# Altium project 2024_WSB.PrjPcb (part 1 of 3)
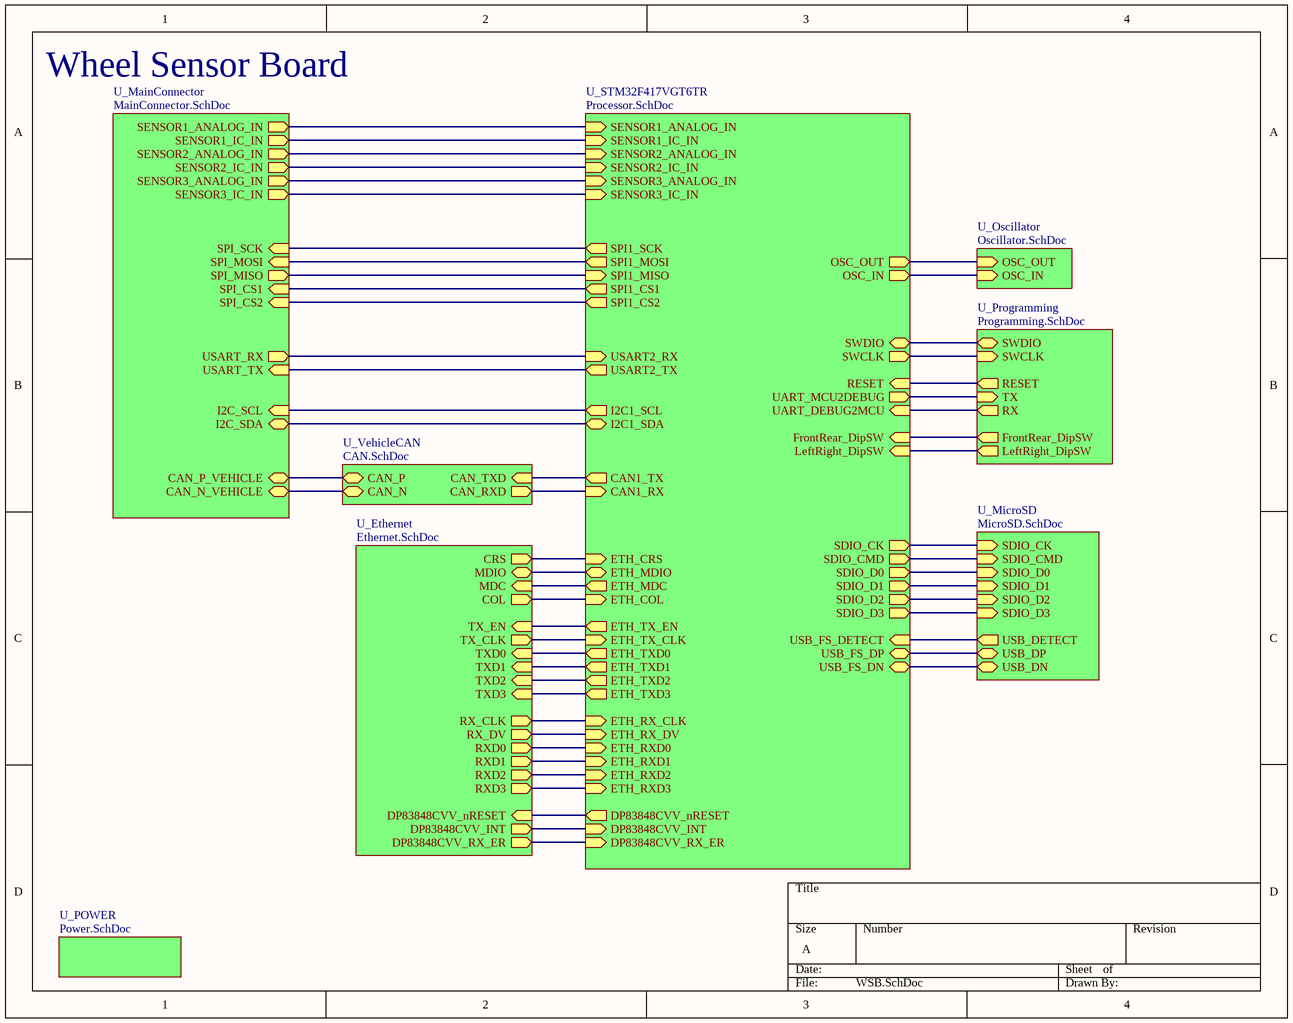
[diagram p0: WSB.SchDoc]
11 sheets, 201 parts. Net scope: hierarchical (ports join the sheet entries above them; power ports are global).
Board file: 2024_WSB.PcbDoc
Sheets:
  WSB.SchDoc
    U_MicroSD = MicroSD.SchDoc
    U_Programming = Programming.SchDoc
    U_VehicleCAN = CAN.SchDoc
    U_Oscillator = Oscillator.SchDoc
    U_STM32F417VGT6TR = Processor.SchDoc
    U_MainConnector = MainConnector.SchDoc
      U_SensorInput1 = SensorInput.SchDoc
      U_SensorInput2 = SensorInput.SchDoc
      U_SensorInput3 = SensorInput.SchDoc
      U_SensorPower2 = SensorPower.SchDoc
      U_SensorPower1 = SensorPower.SchDoc
      U_SensorPower3 = SensorPower.SchDoc
      U_I2CSensorPower1 = SensorPower.SchDoc
      U_I2CSensorPower2 = SensorPower.SchDoc
      U_SPISensorPower1 = SensorPower.SchDoc
      U_SPISensorPower2 = SensorPower.SchDoc
    U_Ethernet = Ethernet.SchDoc
    U_POWER = Power.SchDoc

## Sheet WSB.SchDoc
size A; SheetNumber: 1; SheetTotal: 11

### Sub-sheets
U_Ethernet = Ethernet.SchDoc: DP83848CVV_INT (out), DP83848CVV_nRESET (in), CRS (out), RX_CLK (out), MDIO (bidir), COL (out), RX_DV (out), RXD2 (out), RXD3 (out), TX_EN (in), TXD0 (in), TXD1 (in), MDC (in), TXD2 (in), TX_CLK (out), RXD0 (out), RXD1 (out), TXD3 (in), DP83848CVV_RX_ER (out)
U_MainConnector = MainConnector.SchDoc: CAN_N_VEHICLE (bidir), CAN_P_VEHICLE (bidir), I2C_SDA (bidir), I2C_SCL (in), USART_TX (in), USART_RX (out), SPI_SCK (in), SPI_MOSI (in), SPI_MISO (out), SPI_CS1 (in), SPI_CS2 (in), SENSOR1_ANALOG_IN (out), SENSOR1_IC_IN (out), SENSOR2_ANALOG_IN (out), SENSOR2_IC_IN (out), SENSOR3_ANALOG_IN (out), SENSOR3_IC_IN (out)
U_MicroSD = MicroSD.SchDoc: SDIO_CK (in), SDIO_CMD (in), SDIO_D0 (in), SDIO_D1 (in), SDIO_D2 (in), SDIO_D3 (in), USB_DETECT (out), USB_DN (bidir), USB_DP (bidir)
U_Oscillator = Oscillator.SchDoc: OSC_IN (in), OSC_OUT (in)
U_POWER = Power.SchDoc: no entries
U_Programming = Programming.SchDoc: SWDIO (bidir), SWCLK (in), RESET (out), TX (in), RX (out), FrontRear_DipSW (out), LeftRight_DipSW (out)
U_STM32F417VGT6TR = Processor.SchDoc: SDIO_D0 (out), SDIO_D1 (out), SDIO_D2 (out), SDIO_D3 (out), SDIO_CK (out), SDIO_CMD (out), ETH_MDC (out), ETH_MDIO (bidir), I2C1_SCL (out), I2C1_SDA (bidir), SWDIO (bidir), SWCLK (out), UART_DEBUG2MCU (in), UART_MCU2DEBUG (out), CAN1_TX (out), RESET (in), ETH_COL (in), ETH_CRS (in), ETH_RXD0 (in), ETH_RXD1 (in), ETH_RXD2 (in), ETH_RXD3 (in), ETH_RX_CLK (in), ETH_RX_DV (in), ETH_TXD0 (out), ETH_TXD1 (out), ETH_TXD2 (out), ETH_TXD3 (out), ETH_TX_CLK (in), ETH_TX_EN (out), USB_FS_DN (bidir), USB_FS_DP (bidir), OSC_OUT (out), OSC_IN (out), USB_FS_DETECT (in), DP83848CVV_INT (in), DP83848CVV_nRESET (out), DP83848CVV_RX_ER (in), SPI1_SCK (out), SPI1_MOSI (out), USART2_TX (out), USART2_RX (in), SENSOR1_ANALOG_IN (in), SENSOR1_IC_IN (in), SPI1_MISO (in), SENSOR2_ANALOG_IN (in), SENSOR3_ANALOG_IN (in), SENSOR2_IC_IN (in), SENSOR3_IC_IN (in), FrontRear_DipSW (in), LeftRight_DipSW (in), CAN1_RX (in), SPI1_CS1 (out), SPI1_CS2 (out)
U_VehicleCAN = CAN.SchDoc: CAN_P (bidir), CAN_N (bidir), CAN_TXD (in), CAN_RXD (out)

### Nets
CAN_CONN_H: sheet U_VehicleCAN/CAN_P, sheet U_MainConnector/CAN_P_VEHICLE
CAN_CONN_L: sheet U_VehicleCAN/CAN_N, sheet U_MainConnector/CAN_N_VEHICLE
I2C_SCL: sheet U_STM32F417VGT6TR/I2C1_SCL, sheet U_MainConnector/I2C_SCL
I2C_SDA: sheet U_STM32F417VGT6TR/I2C1_SDA, sheet U_MainConnector/I2C_SDA
MII_MDC: sheet U_STM32F417VGT6TR/ETH_MDC, sheet U_Ethernet/MDC
MII_MDIO: sheet U_STM32F417VGT6TR/ETH_MDIO, sheet U_Ethernet/MDIO
RESET: sheet U_Programming/RESET, sheet U_STM32F417VGT6TR/RESET
SD_CK: sheet U_MicroSD/SDIO_CK, sheet U_STM32F417VGT6TR/SDIO_CK
SD_CMD: sheet U_MicroSD/SDIO_CMD, sheet U_STM32F417VGT6TR/SDIO_CMD
SD_D0: sheet U_MicroSD/SDIO_D0, sheet U_STM32F417VGT6TR/SDIO_D0
SD_D1: sheet U_MicroSD/SDIO_D1, sheet U_STM32F417VGT6TR/SDIO_D1
SD_D2: sheet U_MicroSD/SDIO_D2, sheet U_STM32F417VGT6TR/SDIO_D2
SD_D3: sheet U_MicroSD/SDIO_D3, sheet U_STM32F417VGT6TR/SDIO_D3
SPI_MISO: sheet U_STM32F417VGT6TR/SPI1_MISO, sheet U_MainConnector/SPI_MISO
SPI_MOSI: sheet U_STM32F417VGT6TR/SPI1_MOSI, sheet U_MainConnector/SPI_MOSI
SPI_SCK: sheet U_STM32F417VGT6TR/SPI1_SCK, sheet U_MainConnector/SPI_SCK
SWCLK: sheet U_Programming/SWCLK, sheet U_STM32F417VGT6TR/SWCLK
SWDIO: sheet U_Programming/SWDIO, sheet U_STM32F417VGT6TR/SWDIO
UART_DGB2MCU: sheet U_Programming/RX, sheet U_STM32F417VGT6TR/UART_DEBUG2MCU
UART_MCU2DGB: sheet U_Programming/TX, sheet U_STM32F417VGT6TR/UART_MCU2DEBUG
USART_RX: sheet U_STM32F417VGT6TR/USART2_RX, sheet U_MainConnector/USART_RX
USART_TX: sheet U_STM32F417VGT6TR/USART2_TX, sheet U_MainConnector/USART_TX
USB_BOARD_N: sheet U_MicroSD/USB_DN, sheet U_STM32F417VGT6TR/USB_FS_DN
USB_BOARD_P: sheet U_MicroSD/USB_DP, sheet U_STM32F417VGT6TR/USB_FS_DP
NetC22_2: sheet U_Oscillator/OSC_IN, sheet U_STM32F417VGT6TR/OSC_IN
NetIC1_7: sheet U_STM32F417VGT6TR/DP83848CVV_INT, sheet U_Ethernet/DP83848CVV_INT
NetIC1_29: sheet U_STM32F417VGT6TR/DP83848CVV_nRESET, sheet U_Ethernet/DP83848CVV_nRESET
NetIC1_41: sheet U_STM32F417VGT6TR/DP83848CVV_RX_ER, sheet U_Ethernet/DP83848CVV_RX_ER
NetR6_1: sheet U_Programming/LeftRight_DipSW, sheet U_STM32F417VGT6TR/LeftRight_DipSW
NetR7_1: sheet U_Programming/FrontRear_DipSW, sheet U_STM32F417VGT6TR/FrontRear_DipSW
NetR10_1: sheet U_Oscillator/OSC_OUT, sheet U_STM32F417VGT6TR/OSC_OUT
NetR11_1: sheet U_STM32F417VGT6TR/ETH_RXD0, sheet U_Ethernet/RXD0
NetR12_1: sheet U_STM32F417VGT6TR/ETH_TXD0, sheet U_Ethernet/TXD0
NetR13_1: sheet U_STM32F417VGT6TR/ETH_RXD1, sheet U_Ethernet/RXD1
NetR14_1: sheet U_STM32F417VGT6TR/ETH_TXD1, sheet U_Ethernet/TXD1
NetR15_1: sheet U_STM32F417VGT6TR/ETH_RXD2, sheet U_Ethernet/RXD2
NetR16_1: sheet U_STM32F417VGT6TR/ETH_TXD2, sheet U_Ethernet/TXD2
NetR17_1: sheet U_STM32F417VGT6TR/ETH_RXD3, sheet U_Ethernet/RXD3
NetR18_1: sheet U_STM32F417VGT6TR/ETH_TXD3, sheet U_Ethernet/TXD3
NetR19_1: sheet U_STM32F417VGT6TR/ETH_TX_CLK, sheet U_Ethernet/TX_CLK
NetR20_1: sheet U_STM32F417VGT6TR/ETH_TX_EN, sheet U_Ethernet/TX_EN
NetR23_1: sheet U_STM32F417VGT6TR/ETH_CRS, sheet U_Ethernet/CRS
NetR24_1: sheet U_STM32F417VGT6TR/ETH_RX_DV, sheet U_Ethernet/RX_DV
NetR25_1: sheet U_STM32F417VGT6TR/ETH_RX_CLK, sheet U_Ethernet/RX_CLK
NetR26_1: sheet U_STM32F417VGT6TR/ETH_COL, sheet U_Ethernet/COL
NetR45_1: sheet U_STM32F417VGT6TR/SPI1_CS2, sheet U_MainConnector/SPI_CS2
NetR46_2: sheet U_STM32F417VGT6TR/SPI1_CS1, sheet U_MainConnector/SPI_CS1
NetR47_1: sheet U_STM32F417VGT6TR/SENSOR1_ANALOG_IN, sheet U_MainConnector/SENSOR1_ANALOG_IN
NetR48_1: sheet U_STM32F417VGT6TR/SENSOR1_IC_IN, sheet U_MainConnector/SENSOR1_IC_IN
NetR49_1: sheet U_STM32F417VGT6TR/SENSOR2_ANALOG_IN, sheet U_MainConnector/SENSOR2_ANALOG_IN
NetR50_1: sheet U_STM32F417VGT6TR/SENSOR2_IC_IN, sheet U_MainConnector/SENSOR2_IC_IN
NetR51_1: sheet U_STM32F417VGT6TR/SENSOR3_ANALOG_IN, sheet U_MainConnector/SENSOR3_ANALOG_IN
NetR52_1: sheet U_STM32F417VGT6TR/SENSOR3_IC_IN, sheet U_MainConnector/SENSOR3_IC_IN
NetR58_2: sheet U_MicroSD/USB_DETECT, sheet U_STM32F417VGT6TR/USB_FS_DETECT
NetU3_81: sheet U_VehicleCAN/CAN_RXD, sheet U_STM32F417VGT6TR/CAN1_RX
NetU3_82: sheet U_VehicleCAN/CAN_TXD, sheet U_STM32F417VGT6TR/CAN1_TX

### Notes on the sheet
- Wheel Sensor Board

## Sheet MicroSD.SchDoc
size A; SheetNumber: 10; SheetTotal: 11
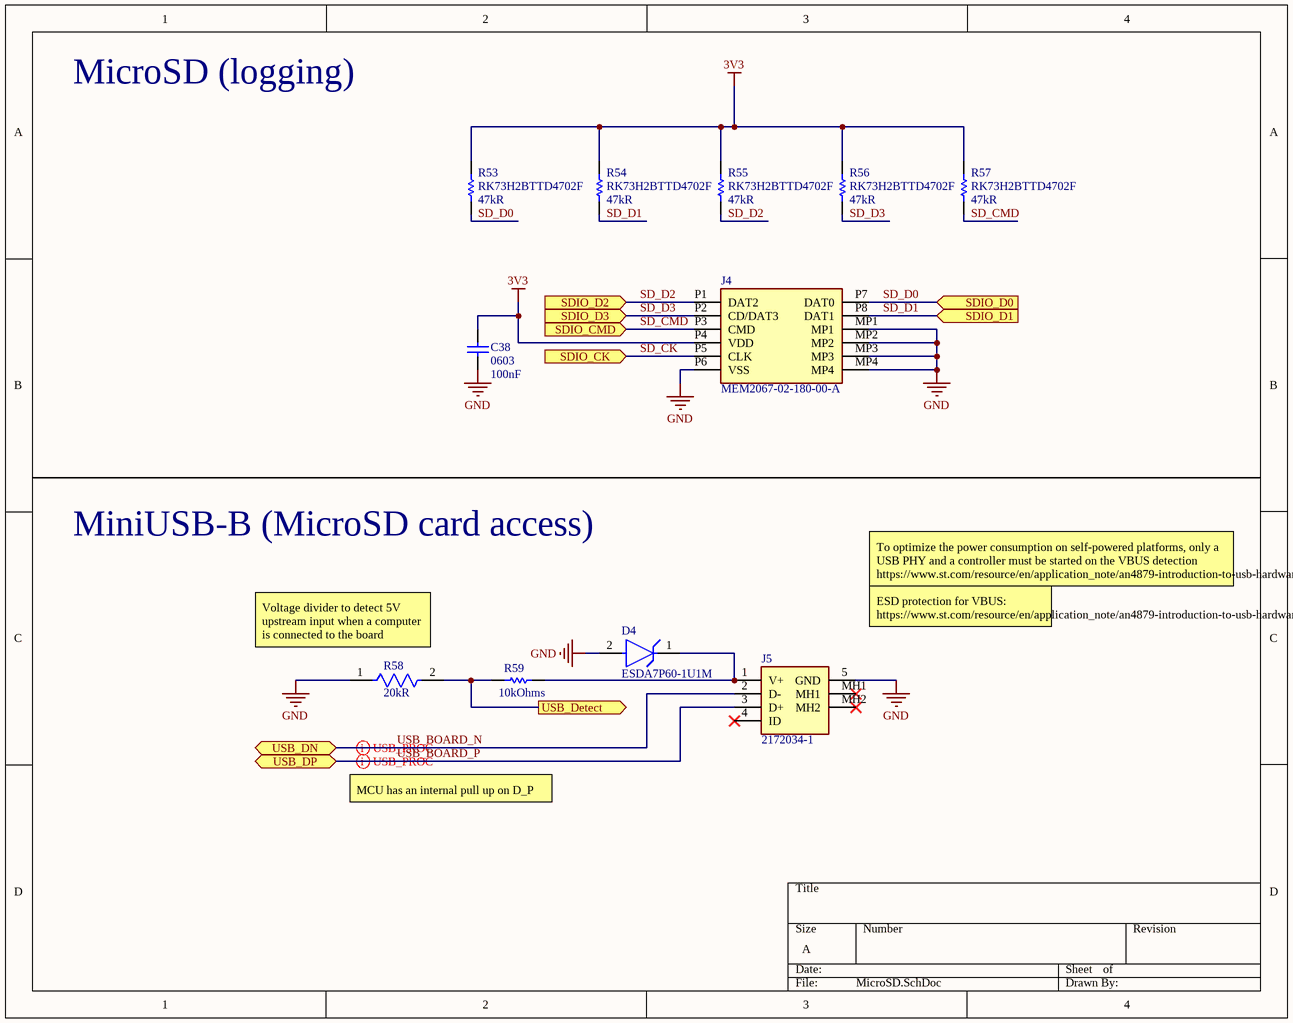
[diagram p1: MicroSD.SchDoc]

### Parts
C38  Case Code (Imperial): 0603  Capacitance: 100nF  [CAPC1608X87X35NL15T15]  (hidden comment: C0603X104K5RACTU)
D4  ESDA7P60-1U1M  [FP-1610-MFG]
J4  MEM2067-02-180-00-A  [MEM20670218000A]
J5  2172034-1  [21720341]
R53  RK73H2BTTD4702F  value 47kR  [RESC3216X70X40NL20T20]
R54  RK73H2BTTD4702F  value 47kR  [RESC3216X70X40NL20T20]
R55  RK73H2BTTD4702F  value 47kR  [RESC3216X70X40NL20T20]
R56  RK73H2BTTD4702F  value 47kR  [RESC3216X70X40NL20T20]
R57  RK73H2BTTD4702F  value 47kR  [RESC3216X70X40NL20T20]
R58  Resistance: 20kR  [FP-CRCW0805-e3-IPC_B]  (hidden comment: CRCW080520K0JNEB)
R59  Resistance: 10kOhms  [RESC1608X55X25ML10T15]  (hidden comment: RC0603JR-0710KL)

### Ports
SDIO_CK (in, see WSB[4C], Processor[2D]), SDIO_CMD (in, see WSB[4C], Processor[3B]), SDIO_D0 (in, see WSB[4C], Processor[2C]), SDIO_D1 (in, see WSB[4C], Processor[2C]), SDIO_D2 (in, see WSB[4C], Processor[2C]), SDIO_D3 (in, see WSB[4C], Processor[2D]), USB_Detect (out, see WSB[4C]), USB_DN (bidir, see WSB[4C]), USB_DP (bidir, see WSB[4C])

### Nets
3V3: C38.1 J4.P4(VDD) R53.2 R54.2 R55.2 R56.2 R57.2
GND: C38.2 D4.2(A) J4.MP1 J4.MP2 J4.MP3 J4.MP4 J4.P6(VSS) J5.5(GND) R58.1
SD_CK: J4.P5(CLK) ; port SDIO_CK
SD_CMD: J4.P3(CMD) R57.1 ; port SDIO_CMD
SD_D0: J4.P7(DAT0) R53.1 ; port SDIO_D0
SD_D1: J4.P8(DAT1) R54.1 ; port SDIO_D1
SD_D2: J4.P1(DAT2) R55.1 ; port SDIO_D2
SD_D3: J4.P2(CD/DAT3) R56.1 ; port SDIO_D3
USB_BOARD_N: J5.2(D-) ; port USB_DN
USB_BOARD_P: J5.3(D+) ; port USB_DP
NetD4_1: D4.1(C) J5.1(V+) R59.2
NetR58_2: R58.2 R59.1 ; port USB_Detect

Not connected (* = marked no-connect by the designer): J5 4(ID)* MH1* MH2*

### Layout directives
differential pair: USB_BOARD_N, USB_BOARD_P

### Notes on the sheet
- MicroSD (logging)
- MiniUSB-B (MicroSD card access)
- (near R58) Voltage divider to detect 5V upstream input when a computer is connected to the board
- ESD protection for VBUS:
  https://www.st.com/resource/en/application_note/an4879-introduction-to-usb-hardware-and-pcb-guidelines-using-stm32-mcus-stmicroelectronics.pdf
- To optimize the power consumption on self-powered platforms, only a USB PHY and a controller must be started on the VBUS detection
  https://www.st.com/resource/en/application_note/an4879-introduction-to-usb-hardware-and-pcb-guidelines-using-stm32-mcus-stmicroelectronics.pdf
- MCU has an internal pull up on D_P

### Library data of the parts
C38 = CMP-2006-03300-1: Manufacturer: Kemet; Dielectric Material: Ceramic; Tolerance: 10%; Voltage Rating: 50V; Dielectric: X7R; Dissipation Factor: 2.5%; Part Number: C0603X104K5RACTU; Supplier 1: Digi-Key; Supplier Part Number 1: 399-7969-1-ND; Manufacturer Part Number: C0603X104K5RACTU; Stock 1: 2206541; Pricing 1: 1 = 0.21000, 10 = 0.14500, 100 = 0.07340, 500 = 0.05024, 1000 = 0.04444 (USD); RoHS: Yes; Mount: Surface Mount; Case/Package: 0603; Number of Pins: 2; Case Code (Metric): 1608; Min Operating Temperature: -55°C; Max Operating Temperature: 125°C; Packaging: Tape and Reel; Package Quantity: 1; Voltage Rating (DC): 50V; Termination: SMD/SMT; Voltage: 50V; Features: Soft Termination; Length: 1.6mm; Height: 0.8mm; Width: 0.8mm; Depth: 0.8mm; Thickness: 0.034inch; Radiation Hardening: No; REACH SVHC: No SVHC; ComponentLink1URL: https://datasheet.ciiva.com/7823/1776088-7823908.pdf?src-supplier=Element14; ComponentLink1Description: https://datasheet.ciiva.com/7823/1776088-7823908.pdf?src-supplier=Element14; ComponentLink2URL: https://datasheet.ciiva.com/26948/getdatasheetpartid-385607-26948458.pdf?src-supplier=Verical; ComponentLink2Description: https://datasheet.ciiva.com/26948/getdatasheetpartid-385607-26948458.pdf?src-supplier=Verical; ComponentLink3URL: https://datasheet.ciiva.com/7823/1776088-7823909.pdf?src-supplier=Element14; ComponentLink3Description: https://datasheet.ciiva.com/7823/1776088-7823909.pdf?src-supplier=Element14; ComponentLink4URL: https://datasheet.ciiva.com/6279/kem-c1013-x7r-ft-cap-smd-6279993.pdf?src-supplier=Digi-Key; ComponentLink4Description: https://datasheet.ciiva.com/6279/kem-c1013-x7r-ft-cap-smd-6279993.pdf?src-supplier=Digi-Key; ComponentLink5URL: https://datasheet.ciiva.com/28533/1918693-28533212.pdf?src-supplier=Element14; ComponentLink5Description: https://datasheet.ciiva.com/28533/1918693-28533212.pdf?src-supplier=Element14; ComponentLink6URL: https://datasheet.ciiva.com/6279/kem-c1013-x7r-ft-cap-smd-6279999.pdf?src-supplier=Digi-Key; ComponentLink6Description: https://datasheet.ciiva.com/6279/kem-c1013-x7r-ft-cap-smd-6279999.pdf?src-supplier=Digi-Key; ComponentLink7URL: https://datasheet.ciiva.com/6279/kem-c1013-x7r-ft-cap-smd-6279990.pdf?src-supplier=Digi-Key; ComponentLink7Description: https://datasheet.ciiva.com/6279/kem-c1013-x7r-ft-cap-smd-6279990.pdf?src-supplier=Digi-Key; ComponentLink8URL: https://datasheet.ciiva.com/14597/70096394-14597743.pdf?src-supplier=Allied+Electronics; ComponentLink8Description: https://datasheet.ciiva.com/14597/70096394-14597743.pdf?src-supplier=Allied+Electronics
D4 = CMP-12225-000013-1: TVS DIODE 5V 11.6V 1610; Manufacturer: STMicroelectronics; Number Of Channels: 1; Standoff Height: 0mm; Breakdown Voltage: 6.4V; Direction: Unidirectional; Clamping Voltage: 10.2V; Peak Pulse Power: 700W; Peak Pulse Current: 60A; Max Junction Temp: +150°C; ComponentLink2Description: Datasheet; Temperature Range Low: -55°C; Package: 1610; Lead Free: Yes; Temperature Range High: +150°C; Temperature: -55°C to +150°C; Device Class L2: TVS Diodes; Category: Diode; Device Class L1: Circuit Protection; Manufacturer Part Number: ESDA7P60-1U1M; Digikey Description: TVS DIODE 5V 11.6V 1610; ComponentLink2URL: http://www.st.com/content/ccc/resource/technical/document/datasheet/44/e9/26/44/42/ee/4f/e5/DM00139972.pdf/files/DM00139972.pdf/jcr:content/translations/en.DM00139972.pdf; Reverse Standoff Voltage: 5V; RoHS: TRUE; Octopart: https://octopart.com/esda7p60-1u1m-stmicroelectronics-52112702; Height: 0.65mm; Device Class L3: unset; Automotive: No
J4 = MEM2067-02-180-00-A: Connector; Manufacturer_Name: GCT (GLOBAL CONNECTOR TECHNOLOGY); Datasheet Link: https://gct.co/files/drawings/mem2067.pdf; Height: 1.95mm; Manufacturer_Part_Number: MEM2067-02-180-00-A; Mouser Part Number: 640-MEM20670218000A; Mouser Price/Stock: https://www.mouser.co.uk/ProductDetail/GCT/MEM2067-02-180-00-A?qs=KUoIvG%2F9IlYTw%2Fcc1GlNJA%3D%3D; Supplier 1: Future Electronics; Supplier Part Number 1: 7054324
J5 = 2172034-1: Connector; Manufacturer_Name: TE Connectivity; Datasheet Link: https://www.te.com/commerce/DocumentDelivery/DDEController?Action=srchrtrv&DocNm=2172034&DocType=Customer+Drawing&DocLang=English; Height: 3.9mm; Manufacturer_Part_Number: 2172034-1; Mouser Part Number: 571-2172034-1; Mouser Price/Stock: https://www.mouser.co.uk/ProductDetail/TE-Connectivity/2172034-1?qs=Ev%252BS503VEAHBC%252BPBdsvCGg%3D%3D; Arrow Part Number: 2172034-1; Arrow Price/Stock: https://www.arrow.com/en/products/2172034-1/te-connectivity?region=nac; Supplier 1: Avnet; Supplier Part Number 1: 68AH8515
R53-R57 = CMP-2003-01472-1: Manufacturer: KOA Speer; Part Number: RK73H2BTTD4702F
R58 = CMP-02407-010660-1: RES Thick Film, 20kΩ, 5%, 0.125W, 200ppm/°C, 0805; Voltage Rating: 150V; Max Power Dissipation: 125mW; Case/Package: 0805; Number of Terminations: 2; Features: Automotive AEC-Q200; Tolerance: 5%; Height: 0.02inch; Case Code (Metric): 2012; Temperature Coefficient: 200ppm/°C; Max Operating Temperature: 155°C; Min Operating Temperature: -55°C; Length: 0.079inch; Weight: 0.000194oz; Case Code (Imperial): 0805; Composition: Thick Film; Width: 1.25mm; Lead Free: Lead Free; Power Rating: 125mW; Packaging: Tape and Reel; Termination: SMD/SMT; Package Quantity: 10000
R59 = CMP-2000-05022-1: Resistor, 10 KOhm, +/- 5%, 100 mW, -55 to 155 degC, 0603 (1608 Metric), RoHS, Tape and Reel; Manufacturer: Yageo; Voltage Rating: 50V; Temperature Coefficient: 100PPM/C; Power Rating: 100mW; Package Reference: 603; Series: RC; Case Code - mm: 1608; Packaging: Reel; Datasheet URL: http://www.farnell.com/datasheets/443971.pdf; Datasheet Version: Rev. 4, 04/2009; Operating Temperature Range: -55Cto+155C; Product: ThickFilmResistorsGeneralPurpose; Package Description: 2-Pin Surface Mount Device, Body 1.6 x 0.8 mm; Manufacturer URL: http://www.yageo.com/; Case Code - in: 0603; Tolerance: 5%; Termination Style: SMD/SMT

## Sheet Programming.SchDoc
size A4; DocumentNumber: 3; SheetNumber: 3; SheetTotal: 11
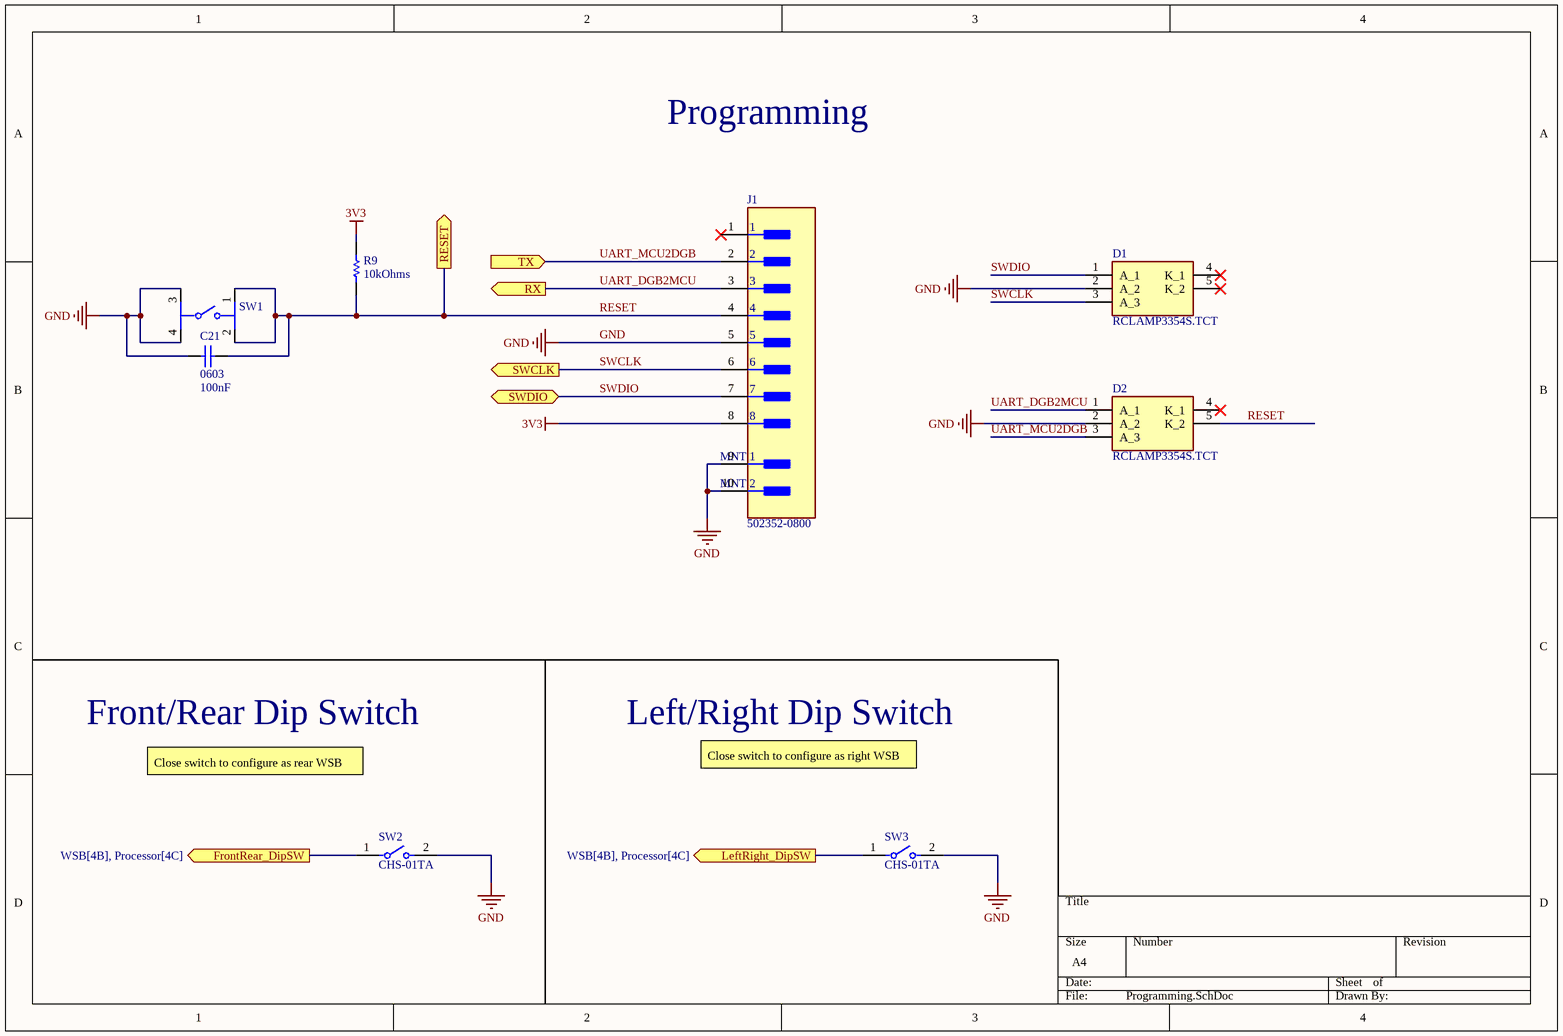
[diagram p2: Programming.SchDoc]

### Parts
C21  Case Code (Imperial): 0603  Capacitance: 100nF  [CAPC1608X87X35NL15T15]  (hidden comment: C0603X104K5RACTU)
D1  RCLAMP3354S.TCT  [SOT95P280X145-5N]
D2  RCLAMP3354S.TCT  [SOT95P280X145-5N]
J1  502352-0800  [FP-502352-0800-MFG]
R9  Resistance: 10kOhms  [RESC1608X55X25ML10T15]  (hidden comment: RC0603JR-0710KL)
SW1  PTS645SM43SMTR92LFS  [FP-PTS645SM43SMTR92LFS-MFG]  (value not drawn)
SW2  CHS-01TA  [FP-CHS-01TA-MFG]
SW3  CHS-01TA  [FP-CHS-01TA-MFG]

### Ports
FrontRear_DipSW (out, see WSB[4B], Processor[4C]), LeftRight_DipSW (out, see WSB[4B], Processor[4C]), RESET (out, see WSB[4B], Processor[3B]), RX (out, see WSB[4B]), SWCLK (out, see WSB[4B], Processor[2B]), SWDIO (bidir, see WSB[4B], Processor[2B]), TX (in, see WSB[4B])

### Nets
3V3: J1.8 R9.2
GND: C21.2 D1.2(A_2) D2.2(A_2) J1.5 J1.9(MNT_1) J1.10(MNT_2) SW1.3 SW1.4 SW2.2 SW3.2
RESET: C21.1 D2.5(K_2) J1.4 R9.1 SW1.1 SW1.2 ; port RESET
SWCLK: D1.3(A_3) J1.6 ; port SWCLK
SWDIO: D1.1(A_1) J1.7 ; port SWDIO
UART_DGB2MCU: D2.1(A_1) J1.3 ; port RX
UART_MCU2DGB: D2.3(A_3) J1.2 ; port TX
NetR6_1: SW3.1 ; port LeftRight_DipSW
NetR7_1: SW2.1 ; port FrontRear_DipSW

Not connected (* = marked no-connect by the designer): D1 4(K_1)* 5(K_2)*; D2 4(K_1)*; J1 1*

### Notes on the sheet
- Programming
- Front/Rear Dip Switch
- Close switch to configure as rear WSB
- Left/Right Dip Switch
- Close switch to configure as right WSB

### Library data of the parts
C21 = CMP-2006-03300-1: as C38 on sheet MicroSD; Part Number: C0603X104K5RACTU; Supplier 1: Digi-Key; Supplier Part Number 1: 399-7969-1-ND; Manufacturer Part Number: C0603X104K5RACTU; Stock 1: 2206541; Pricing 1: 1 = 0.21000, 10 = 0.14500, 100 = 0.07340, 500 = 0.05024, 1000 = 0.04444 (USD); RoHS: Yes; Mount: Surface Mount; Case/Package: 0603; Number of Pins: 2; Case Code (Metric): 1608; Min Operating Temperature: -55°C; Max Operating Temperature: 125°C; Packaging: Tape and Reel; Package Quantity: 1; Voltage Rating (DC): 50V; Termination: SMD/SMT; Voltage: 50V; Features: Soft Termination; Length: 1.6mm; Height: 0.8mm; Width: 0.8mm; Depth: 0.8mm; Thickness: 0.034inch; Radiation Hardening: No; REACH SVHC: No SVHC; ComponentLink1URL: https://datasheet.ciiva.com/7823/1776088-7823908.pdf?src-supplier=Element14; ComponentLink1Description: https://datasheet.ciiva.com/7823/1776088-7823908.pdf?src-supplier=Element14; ComponentLink2URL: https://datasheet.ciiva.com/26948/getdatasheetpartid-385607-26948458.pdf?src-supplier=Verical; ComponentLink2Description: https://datasheet.ciiva.com/26948/getdatasheetpartid-385607-26948458.pdf?src-supplier=Verical; ComponentLink3URL: https://datasheet.ciiva.com/7823/1776088-7823909.pdf?src-supplier=Element14; ComponentLink3Description: https://datasheet.ciiva.com/7823/1776088-7823909.pdf?src-supplier=Element14; ComponentLink4URL: https://datasheet.ciiva.com/6279/kem-c1013-x7r-ft-cap-smd-6279993.pdf?src-supplier=Digi-Key; ComponentLink4Description: https://datasheet.ciiva.com/6279/kem-c1013-x7r-ft-cap-smd-6279993.pdf?src-supplier=Digi-Key; ComponentLink5URL: https://datasheet.ciiva.com/28533/1918693-28533212.pdf?src-supplier=Element14; ComponentLink5Description: https://datasheet.ciiva.com/28533/1918693-28533212.pdf?src-supplier=Element14; ComponentLink6URL: https://datasheet.ciiva.com/6279/kem-c1013-x7r-ft-cap-smd-6279999.pdf?src-supplier=Digi-Key; ComponentLink6Description: https://datasheet.ciiva.com/6279/kem-c1013-x7r-ft-cap-smd-6279999.pdf?src-supplier=Digi-Key; ComponentLink7URL: https://datasheet.ciiva.com/6279/kem-c1013-x7r-ft-cap-smd-6279990.pdf?src-supplier=Digi-Key; ComponentLink7Description: https://datasheet.ciiva.com/6279/kem-c1013-x7r-ft-cap-smd-6279990.pdf?src-supplier=Digi-Key; ComponentLink8URL: https://datasheet.ciiva.com/14597/70096394-14597743.pdf?src-supplier=Allied+Electronics; ComponentLink8Description: https://datasheet.ciiva.com/14597/70096394-14597743.pdf?src-supplier=Allied+Electronics
D1 D2 = RCLAMP3354S.TCT: TVS Diode (Bi-directional); Manufacturer_Name: SEMTECH; Datasheet Link: https://semtech.my.salesforce.com/sfc/p/#E0000000JelG/a/44000000MCrm/q3IJaquvh9BkANCL4E8HYT8vxS.k3jwPHRhsWr6XNsI; Height: 1.45mm; Manufacturer_Part_Number: RCLAMP3354S.TCT; Mouser Part Number: 947-RCLAMP3354S.TCT; Mouser Price/Stock: https://www.mouser.co.uk/ProductDetail/Semtech/RCLAMP3354S.TCT?qs=rBWM4%252BvDhIcjyMg1J9MbMw%3D%3D; Arrow Part Number: RCLAMP3354S.TCT; Arrow Price/Stock: https://www.arrow.com/en/products/rclamp3354s.tct/semtech?region=europe
  D1: Supplier 1: Arrow Electronics; Supplier Part Number 1: RCLAMP3354S.TCT
J1 = CMP-04776-000280-1: CONN HEADER SMD R/A 8POS 2MM; Max Current Rating: 3A; Primary Type: Rectangular; Number of Contacts: 8; Gender: Male; Connector Type: Male Pin; Glow Wire Compliant: Non-compliant; Voltage Rating: 125V; Orientation: Right Angle; Contact Plating: Tin; Series: DuraClik™ 502352; Color: Natural; Mount: Surface Mount; Contact Gender: Male; Length: 20mm; Radiation Hardening: No; Max Operating Temperature: 105°C; Package Quantity: 2800; Housing Material: Polyamide; Depth: 9.4mm; Current Rating: 3A; Pitch: 2mm; Housing Color: Natural; Contact Type: Male Pin; Number of Circuits: 8; Contact Material: Copper Alloy; Fastening Type: Latch; Number of Positions: 8; Packaging: Tape and Reel; Termination: Solder; Number of Rows: 1; Min Operating Temperature: -40°C
R9 = CMP-2000-05022-1: as R59 on sheet MicroSD; Package Reference: 603; Series: RC; Case Code - mm: 1608; Packaging: Reel; Datasheet URL: http://www.farnell.com/datasheets/443971.pdf; Datasheet Version: Rev. 4, 04/2009; Operating Temperature Range: -55Cto+155C; Product: ThickFilmResistorsGeneralPurpose; Package Description: 2-Pin Surface Mount Device, Body 1.6 x 0.8 mm; Manufacturer URL: http://www.yageo.com/; Case Code - in: 0603; Tolerance: 5%; Termination Style: SMD/SMT
SW1 = CMP-2000-05160-2: SWITCH TACTILE SPST-NO 0.05A 12V; Contact Resistance: 100mR; Throw Configuration: SPST; Illumination Type: Non-Illuminated; Mechanical Life: 100000Cycles; Current Rating: 50mA; Switch Function: Off-Mom; Actuator Length: 0.85mm; Actuator Material: Nylon; Actuator Type: Standard; Operating Force: 160gf; Min Operating Temperature: -20°C; REACH SVHC: No SVHC; Termination: Gull Wing; Case/Package: SMD/SMT; Packaging: Tape and Reel; Mount: Surface Mount; Voltage Rating (DC): 12V; Orientation: Straight; Lead Free: Lead Free; Contact Material: Silver; Color: Black; Max Current Rating: 50mA; Contact Plating: Silver; Depth: 9mm; Package Quantity: 1; Max Voltage Rating (DC): 12V; Length: 6mm; Max Operating Temperature: 60°C
SW2 SW3 = CMP-71740-000003-1: SWITCH SLIDE DIP SPST 100MA 6V; Manufacturer: Nidec Copal Electronics; Contact Resistance: 50mΩ; Standoff Height: 0mm; Number Of Circuits: 1; Electromechanical Life: 2000Cycles; Device Class L1: Electromechanical; Device Class L2: Switches; Category: Switch; Temperature Range Low: -40°C; Device Class L3: DIP Switches; Height: 2.5mm; Lead Free: Yes; Octopart: https://octopart.com/chs-01ta-nidec+copal-52304644; Throw Configuration: SPST; Package: CHS-01TA; Voltage Rating Dc: 6V; Digikey Description: SWITCH SLIDE DIP SPST 100MA 6V; Mount: Surface Mount; Automotive: No; Contact Current Rating: 100mA; ComponentLink2URL: https://www.nidec-copal-electronics.com/e/catalog/switch/chs.pdf; ComponentLink2Description: Datasheet; Temperature: -40°C to +85°C; Temperature Range High: +85°C; RoHS: TRUE; Manufacturer Part Number: CHS-01TA

## Sheet CAN.SchDoc
size A; SheetNumber: 5; SheetTotal: 11
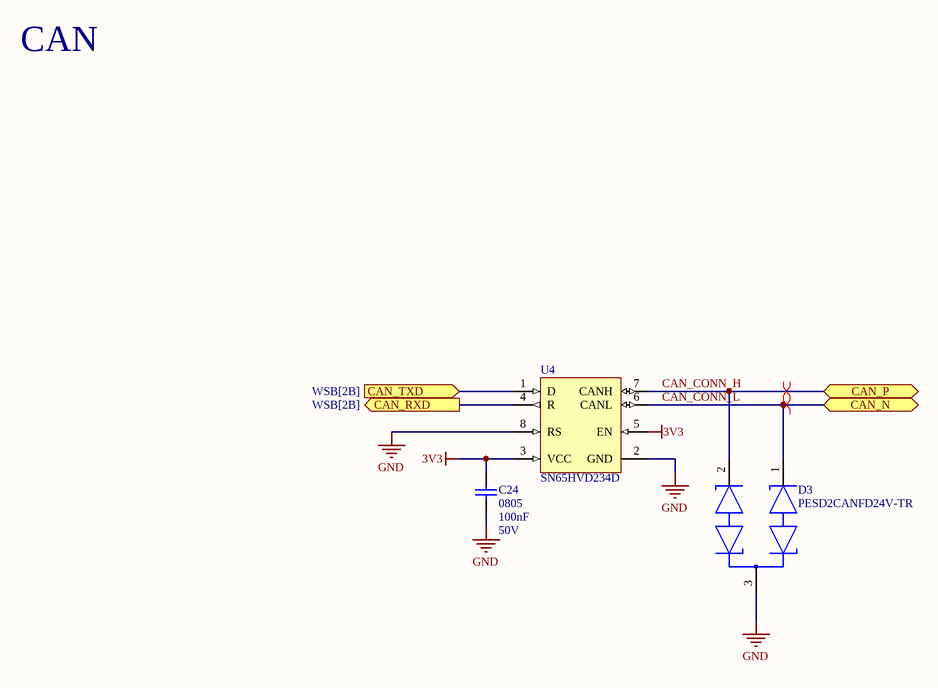
[diagram p3: CAN.SchDoc]

### Parts
C24  Case Code (Imperial): 0805  Capacitance: 100nF  Voltage Rating: 50V  [CAPC2013X88X50NL20T25]  (hidden comment: C0805C104K5RACTU)
D3  PESD2CANFD24V-TR  [FP-SOT23-IPC_A]
U4  SN65HVD234D  [D0008A_M]

### Ports
CAN_N (bidir, see WSB[2B]), CAN_P (bidir, see WSB[2B]), CAN_RXD (out, see WSB[2B]), CAN_TXD (in, see WSB[2B])

### Nets
3V3: C24.1 U4.3(VCC) U4.5(EN)
GND: C24.2 D3.3(CC) U4.2(GND) U4.8(RS)
CAN_CONN_H: D3.2(K2) U4.7(CANH) ; port CAN_P
CAN_CONN_L: D3.1(K1) U4.6(CANL) ; port CAN_N
NetU3_81: U4.4(R) ; port CAN_RXD
NetU3_82: U4.1(D) ; port CAN_TXD

### Layout directives
differential pair: CAN_CONN_H, CAN_CONN_L

### Notes on the sheet
- CAN

### Library data of the parts
C24 = CMP-2007-00279-1: Manufacturer: Kemet; Dielectric Material: Ceramic; Tolerance: 10%; Dielectric: X7R; Voltage: 500V; Part Number: C0805C104K5RACTU; Supplier 1: Digi-Key; Supplier Part Number 1: 399-1170-1-ND; Manufacturer Part Number: C0805C104K5RACTU; Stock 1: 1913908; Pricing 1: 1 = 0.23000, 10 = 0.16600, 100 = 0.07800, 500 = 0.05472, 1000 = 0.04530 (USD); RoHS: Yes; Mount: Surface Mount; Case/Package: 0805; Number of Pins: 2; Case Code (Metric): 2012; Contact Plating: Tin; Min Operating Temperature: -55°C; Max Operating Temperature: 125°C; Packaging: Tape and Reel; Voltage Rating (DC): 50V; Package Quantity: 1; Termination: SMD/SMT; Length: 2mm; Height: 0.9mm; Depth: 1.25mm; Width: 1.2mm; Thickness: 0.035inch; Lead Pitch: 0.75mm; Radiation Hardening: No; REACH SVHC: No SVHC; ComponentLink1URL: https://datasheet.ciiva.com/14589/70095383-14589048.pdf?src-supplier=Allied+Electronics; ComponentLink1Description: https://datasheet.ciiva.com/14589/70095383-14589048.pdf?src-supplier=Allied+Electronics; ComponentLink2URL: https://datasheet.ciiva.com/28682/1851736-28682232.pdf?src-supplier=Element14; ComponentLink2Description: https://datasheet.ciiva.com/28682/1851736-28682232.pdf?src-supplier=Element14; ComponentLink3URL: https://datasheet.ciiva.com/32431/slceramic-chip-condensers-e-32431755.pdf?src-supplier=Distrelec; ComponentLink3Description: https://datasheet.ciiva.com/32431/slceramic-chip-condensers-e-32431755.pdf?src-supplier=Distrelec; ComponentLink4URL: https://datasheet.ciiva.com/18410/70095383-18410815.pdf?src-supplier=Allied+Electronics; ComponentLink4Description: https://datasheet.ciiva.com/18410/70095383-18410815.pdf?src-supplier=Allied+Electronics
D3 = CMP-14436-000014-1: TVS DIODE 24VWM 42VC TO236AB
U4 = CMP-0315-00083-2: 3.3V CAN Transceiver with Sleep Mode, 6 mA, -40 to 125 degC, 8-pin SOIC (D), Green (RoHS & no Sb/Br); Manufacturer: Texas Instruments; Rating: Catalog; Receivers Per Package: 1; Bus Fault Voltage(V): +/-30; Transient Pulse Protection(V): -100 to 100; ICC(Max)(mA): 6; Supply Voltage(s)(V): 3.3; DatasheetVersion: SLLS557F; PackageVersion: revM, Jun-2011; Eco-Plan: Green (RoHS & no Sb/Br); PackageReference: D0008A; Drivers Per Package: 1; SubFamily: CAN; Code_JEDEC: MS-012AA; Isolated: No; ComponentLink1URL: http://www.ti.com/general/docs/lit/getliterature.tsp?genericPartNumber=SN65HVD234&fileType=pdf; Mounting Technology: Surface Mount; PackageDescription: 8-Pin Plastic Small Outline Integrated Circuit, 4.9 x 3.9 mm, Pitch 1.27 mm Pitch; PartNumber: SN65HVD234D; Footprint: PCA82C250, excludes pin5; Low Power Mode: Sleep; ComponentLink1Description: Datasheet

## Sheet Oscillator.SchDoc
size A; SheetNumber: 4; SheetTotal: 11
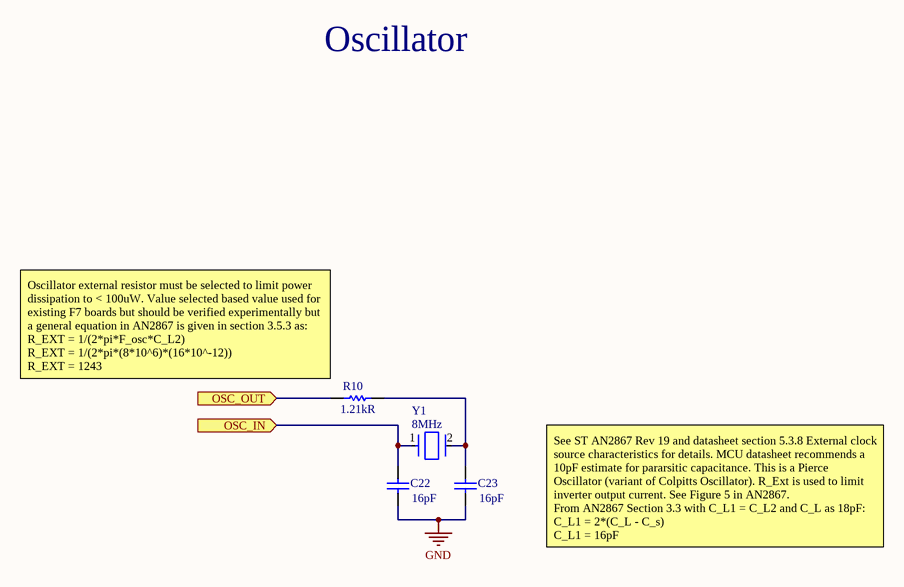
[diagram p4: Oscillator.SchDoc]

### Parts
C22  Capacitance: 16pF  [CAPC1608X90X35ML15T15]  (hidden comment: 06035A160JAT2A)
C23  Capacitance: 16pF  [CAPC1608X90X35ML15T15]  (hidden comment: 06035A160JAT2A)
R10  Resistance: 1.21kR  [RESC1005X40X25NL10T10]  (hidden comment: CR0402-FX-1211GLF)
Y1  Frequency: 8MHz  [FP-ABM3-MFG]  (hidden comment: ABM3-8.000MHZ-D2Y-T)

### Ports
OSC_IN (in, see WSB[4B], Processor[3B]), OSC_OUT (in, see WSB[4B], Processor[3B])

### Nets
GND: C22.1 C23.1
NetC22_2: C22.2 Y1.1 ; port OSC_IN
NetC23_2: C23.2 R10.2 Y1.2
NetR10_1: R10.1 ; port OSC_OUT

### Notes on the sheet
- Oscillator
- (near R10) Oscillator external resistor must be selected to limit power dissipation to < 100uW. Value selected based value used for existing F7 boards but should be verified experimentally but a general equation in AN2867 is given in section 3.5.3 as:
  R_EXT = 1/(2*pi*F_osc*C_L2)
  R_EXT = 1/(2*pi*(8*10^6)*(16*10^-12))
  R_EXT = 1243
- See ST AN2867 Rev 19 and datasheet section 5.3.8 External clock source characteristics for details. MCU datasheet recommends a 10pF estimate for pararsitic capacitance. This is a Pierce Oscillator (variant of Colpitts Oscillator). R_Ext is used to limit inverter output current. See Figure 5 in AN2867.
  From AN2867 Section 3.3 with C_L1 = C_L2 and C_L as 18pF:
  C_L1 = 2*(C_L - C_s)
  C_L1 = 16pF

### Library data of the parts
C22 C23 = CMP-2006-04247-1: Manufacturer: AVX Interconnect / Elco; Part Number: 06035A160JAT2A
R10 = CMP-2002-04749-1: Manufacturer: Bourns; Part Number: CR0402-FX-1211GLF
Y1 = CMP-2000-05033-2: Crystal 8MHz ±20ppm 18pF SMD-2 5mm x 3.2mm; Series Resistance: 500R; Frequency Stability: 30ppm; ESR (Equivalent Series Resistance): 140R; Load Capacitance: 18pF; Height: 0.051inch; Tolerance: 20ppm; Depth: 3.2mm; Max Operating Temperature: 85°C; Termination: SMD/SMT; Lead Free: Lead Free; Number of Pins: 2; Width: 3.2mm; RoHS Compliant: Yes; Resistor Type: Ceramic; Length: 5mm; Mount: Surface Mount; Case/Package: CSMD; Package Quantity: 1000; Radiation Hardening: No; Min Operating Temperature: -40°C; Packaging: Tape and Reel; Frequency Tolerance: 20ppm

## Sheet Processor.SchDoc
size A4; SheetNumber: 2; SheetTotal: 11
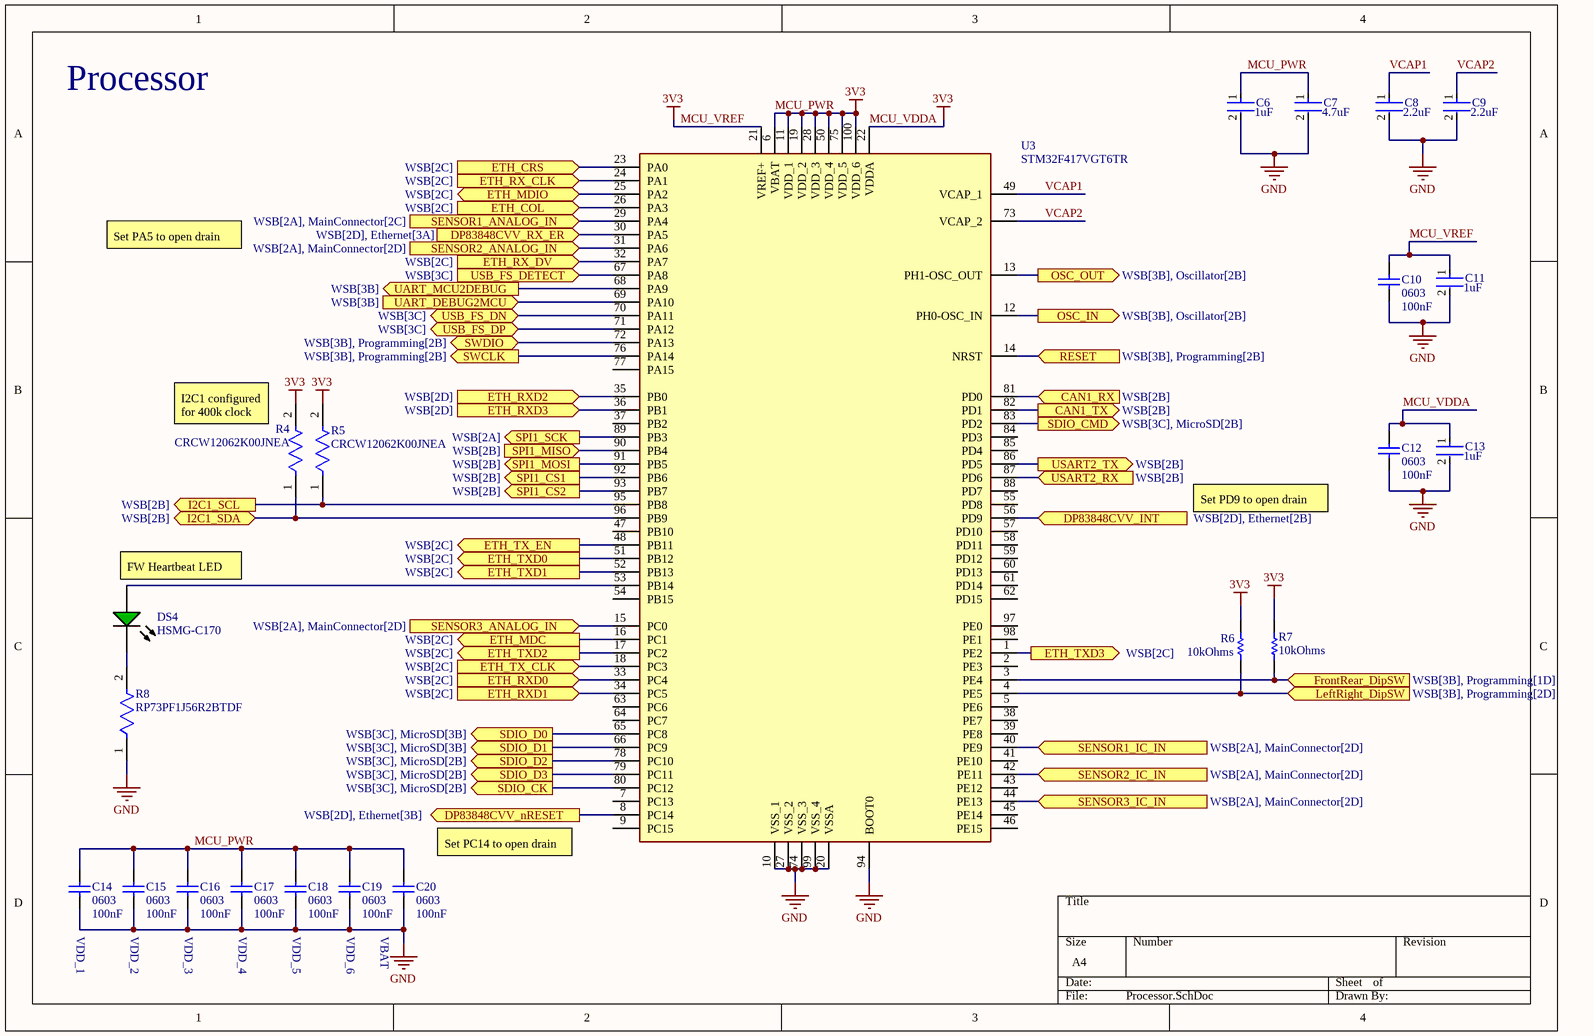
[diagram p5: Processor.SchDoc]

### Parts
C6  Capacitance: 1uF  [FP-CL10-IPC_C]  (hidden comment: CL10A105KA8NNNC)
C7  Capacitance: 4.7uF  [FP-C1005-050-0_15-MFG]  (hidden comment: C1005X5R1A475K050BC)
C8  Capacitance: 2.2uF  [FP-C0603C225K4PACTU-MFG]  (hidden comment: C0603C225K4PACTU)
C9  Capacitance: 2.2uF  [FP-C0603C225K4PACTU-MFG]  (hidden comment: C0603C225K4PACTU)
C10  Case Code (Imperial): 0603  Capacitance: 100nF  [CAPC1608X87X35NL15T15]  (hidden comment: C0603X104K5RACTU)
C11  Capacitance: 1uF  [FP-CL10-IPC_C]  (hidden comment: CL10A105KA8NNNC)
C12  Case Code (Imperial): 0603  Capacitance: 100nF  [CAPC1608X87X35NL15T15]  (hidden comment: C0603X104K5RACTU)
C13  Capacitance: 1uF  [FP-CL10-IPC_C]  (hidden comment: CL10A105KA8NNNC)
C14  Case Code (Imperial): 0603  Capacitance: 100nF  [CAPC1608X87X35NL15T15]  (hidden comment: C0603X104K5RACTU)
C15  Case Code (Imperial): 0603  Capacitance: 100nF  [CAPC1608X87X35NL15T15]  (hidden comment: C0603X104K5RACTU)
C16  Case Code (Imperial): 0603  Capacitance: 100nF  [CAPC1608X87X35NL15T15]  (hidden comment: C0603X104K5RACTU)
C17  Case Code (Imperial): 0603  Capacitance: 100nF  [CAPC1608X87X35NL15T15]  (hidden comment: C0603X104K5RACTU)
C18  Case Code (Imperial): 0603  Capacitance: 100nF  [CAPC1608X87X35NL15T15]  (hidden comment: C0603X104K5RACTU)
C19  Case Code (Imperial): 0603  Capacitance: 100nF  [CAPC1608X87X35NL15T15]  (hidden comment: C0603X104K5RACTU)
C20  Case Code (Imperial): 0603  Capacitance: 100nF  [CAPC1608X87X35NL15T15]  (hidden comment: C0603X104K5RACTU)
DS4  HSMG-C170  [AVAG-HSMX-C170_V]
R4  CRCW12062K00JNEA  [FP-CRCW1206-e3-IPC_B]
R5  CRCW12062K00JNEA  [FP-CRCW1206-e3-IPC_B]
R6  Resistance: 10kOhms  [RESC1608X55X25ML10T15]  (hidden comment: RC0603JR-0710KL)
R7  Resistance: 10kOhms  [RESC1608X55X25ML10T15]  (hidden comment: RC0603JR-0710KL)
R8  RP73PF1J56R2BTDF  [FP-RP73P-1J-MFG]
U3  STM32F417VGT6TR  [STM-LQFP100_N]

### Ports
CAN1_RX (in, see WSB[2B]), CAN1_TX (out, see WSB[2B]), DP83848CVV_INT (in, see WSB[2D], Ethernet[2B]), DP83848CVV_nRESET (out, see WSB[2D], Ethernet[3B]), DP83848CVV_RX_ER (in, see WSB[2D], Ethernet[3A]), ETH_COL (in, see WSB[2C]), ETH_CRS (in, see WSB[2C]), ETH_MDC (out, see WSB[2C]), ETH_MDIO (bidir, see WSB[2C]), ETH_RX_CLK (in, see WSB[2C]), ETH_RX_DV (in, see WSB[2C]), ETH_RXD0 (in, see WSB[2C]), ETH_RXD1 (in, see WSB[2C]), ETH_RXD2 (in, see WSB[2D]), ETH_RXD3 (in, see WSB[2D]), ETH_TX_CLK (in, see WSB[2C]), ETH_TX_EN (out, see WSB[2C]), ETH_TXD0 (out, see WSB[2C]), ETH_TXD1 (out, see WSB[2C]), ETH_TXD2 (out, see WSB[2C]), ETH_TXD3 (out, see WSB[2C]), FrontRear_DipSW (in, see WSB[3B], Programming[1D]), I2C1_SCL (out, see WSB[2B]), I2C1_SDA (bidir, see WSB[2B]), LeftRight_DipSW (in, see WSB[3B], Programming[2D]), OSC_IN (out, see WSB[3B], Oscillator[2B]), OSC_OUT (out, see WSB[3B], Oscillator[2B]), RESET (in, see WSB[3B], Programming[2B]), SDIO_CK (out, see WSB[3C], MicroSD[2B]), SDIO_CMD (out, see WSB[3C], MicroSD[2B]), SDIO_D0 (out, see WSB[3C], MicroSD[3B]), SDIO_D1 (out, see WSB[3C], MicroSD[3B]), SDIO_D2 (out, see WSB[3C], MicroSD[2B]), SDIO_D3 (out, see WSB[3C], MicroSD[2B]), SENSOR1_ANALOG_IN (in, see WSB[2A], MainConnector[2C]), SENSOR1_IC_IN (in, see WSB[2A], MainConnector[2D]), SENSOR2_ANALOG_IN (in, see WSB[2A], MainConnector[2D]), SENSOR2_IC_IN (in, see WSB[2A], MainConnector[2D]), SENSOR3_ANALOG_IN (in, see WSB[2A], MainConnector[2D]), SENSOR3_IC_IN (in, see WSB[2A], MainConnector[2D]), SPI1_CS1 (out, see WSB[2B]), SPI1_CS2 (out, see WSB[2B]), SPI1_MISO (in, see WSB[2B]), SPI1_MOSI (out, see WSB[2B]), SPI1_SCK (out, see WSB[2A]), SWCLK (out, see WSB[3B], Programming[2B]), SWDIO (bidir, see WSB[3B], Programming[2B]), UART_DEBUG2MCU (in, see WSB[3B]), UART_MCU2DEBUG (out, see WSB[3B]), USART2_RX (in, see WSB[2B]), USART2_TX (out, see WSB[2B]), USB_FS_DETECT (in, see WSB[3C]), USB_FS_DN (bidir, see WSB[3C]), USB_FS_DP (bidir, see WSB[3C])

### Nets
3V3: C6.1 C7.1 C10.1 C11.1 C12.1 C13.1 C14.2 C15.2 C16.2 C17.2 C18.2 C19.2 C20.2 R4.2 R5.2 R6.2 R7.2 U3.6(VBAT) U3.11(VDD_1) U3.19(VDD_2) U3.21(VREF+) U3.22(VDDA) U3.28(VDD_3) U3.50(VDD_4) U3.75(VDD_5) U3.100(VDD_6)  [also labelled MCU_PWR, MCU_VDDA, MCU_VREF]
GND: C6.2 C7.2 C8.2 C9.2 C10.2 C11.2 C12.2 C13.2 C14.1 C15.1 C16.1 C17.1 C18.1 C19.1 C20.1 R8.1 U3.10(VSS_1) U3.20(VSSA) U3.27(VSS_2) U3.74(VSS_3) U3.94(BOOT0) U3.99(VSS_4)
I2C_SCL: R5.1 U3.95(PB8) ; port I2C1_SCL
I2C_SDA: R4.1 U3.96(PB9) ; port I2C1_SDA
MII_MDC: U3.16(PC1) ; port ETH_MDC
MII_MDIO: U3.25(PA2) ; port ETH_MDIO
RESET: U3.14(NRST) ; port RESET
SD_CK: U3.80(PC12) ; port SDIO_CK
SD_CMD: U3.83(PD2) ; port SDIO_CMD
SD_D0: U3.65(PC8) ; port SDIO_D0
SD_D1: U3.66(PC9) ; port SDIO_D1
SD_D2: U3.78(PC10) ; port SDIO_D2
SD_D3: U3.79(PC11) ; port SDIO_D3
SPI_MISO: U3.90(PB4) ; port SPI1_MISO
SPI_MOSI: U3.91(PB5) ; port SPI1_MOSI
SPI_SCK: U3.89(PB3) ; port SPI1_SCK
SWCLK: U3.76(PA14) ; port SWCLK
SWDIO: U3.72(PA13) ; port SWDIO
UART_DGB2MCU: U3.69(PA10) ; port UART_DEBUG2MCU
UART_MCU2DGB: U3.68(PA9) ; port UART_MCU2DEBUG
USART_RX: U3.87(PD6) ; port USART2_RX
USART_TX: U3.86(PD5) ; port USART2_TX
USB_BOARD_N: U3.70(PA11) ; port USB_FS_DN
USB_BOARD_P: U3.71(PA12) ; port USB_FS_DP
VCAP1: C8.1 U3.49(VCAP_1)
VCAP2: C9.1 U3.73(VCAP_2)
NetC22_2: U3.12(PH0-OSC_IN) ; port OSC_IN
NetDS4_1: DS4.1(A) U3.53(PB14)
NetDS4_2: DS4.2(K) R8.2
NetIC1_7: U3.56(PD9) ; port DP83848CVV_INT
NetIC1_29: U3.8(PC14) ; port DP83848CVV_nRESET
NetIC1_41: U3.30(PA5) ; port DP83848CVV_RX_ER
NetR6_1: R6.1 U3.4(PE5) ; port LeftRight_DipSW
NetR7_1: R7.1 U3.3(PE4) ; port FrontRear_DipSW
NetR10_1: U3.13(PH1-OSC_OUT) ; port OSC_OUT
NetR11_1: U3.33(PC4) ; port ETH_RXD0
NetR12_1: U3.51(PB12) ; port ETH_TXD0
NetR13_1: U3.34(PC5) ; port ETH_RXD1
NetR14_1: U3.52(PB13) ; port ETH_TXD1
NetR15_1: U3.35(PB0) ; port ETH_RXD2
NetR16_1: U3.17(PC2) ; port ETH_TXD2
NetR17_1: U3.36(PB1) ; port ETH_RXD3
NetR18_1: U3.1(PE2) ; port ETH_TXD3
NetR19_1: U3.18(PC3) ; port ETH_TX_CLK
NetR20_1: U3.48(PB11) ; port ETH_TX_EN
NetR23_1: U3.23(PA0) ; port ETH_CRS
NetR24_1: U3.32(PA7) ; port ETH_RX_DV
NetR25_1: U3.24(PA1) ; port ETH_RX_CLK
NetR26_1: U3.26(PA3) ; port ETH_COL
NetR45_1: U3.93(PB7) ; port SPI1_CS2
NetR46_2: U3.92(PB6) ; port SPI1_CS1
NetR47_1: U3.29(PA4) ; port SENSOR1_ANALOG_IN
NetR48_1: U3.40(PE9) ; port SENSOR1_IC_IN
NetR49_1: U3.31(PA6) ; port SENSOR2_ANALOG_IN
NetR50_1: U3.42(PE11) ; port SENSOR2_IC_IN
NetR51_1: U3.15(PC0) ; port SENSOR3_ANALOG_IN
NetR52_1: U3.44(PE13) ; port SENSOR3_IC_IN
NetR58_2: U3.67(PA8) ; port USB_FS_DETECT
NetU3_81: U3.81(PD0) ; port CAN1_RX
NetU3_82: U3.82(PD1) ; port CAN1_TX

Not connected (* = marked no-connect by the designer): U3 2(PE3) 5(PE6) 7(PC13) 9(PC15) 37(PB2) 38(PE7) 39(PE8) 41(PE10) 43(PE12) 45(PE14) 46(PE15) 47(PB10) 54(PB15) 55(PD8) 57(PD10) 58(PD11) 59(PD12) 60(PD13) 61(PD14) 62(PD15) 63(PC6) 64(PC7) 77(PA15) 84(PD3) 85(PD4) 88(PD7) 97(PE0) 98(PE1)

### Notes on the sheet
- Processor
- Set PA5 to open drain
- (near R4) I2C1 configured for 400k clock
- Set PD9 to open drain
- (near DS4) FW Heartbeat LED
- Set PC14 to open drain
- VDD_1
- VDD_2
- VDD_3
- VDD_4
- VDD_5
- VDD_6
- VBAT

### Library data of the parts
C6 C11 C13 = CMP-13271-004127-1: Cap Ceramic 1uF 25V X5R ±10% Pad SMD 0603 +85°C T/R; Height: 0.8mm; Depth: 0.8mm; Package Quantity: 1; Mount: Surface Mount; Contact Plating: Tin; Voltage Rating: 25V; Dielectric: X5R; Packaging: Tape and Reel; Material: Ceramic; Case Code (Metric): 1608; Length: 1.6mm; Voltage: 25V; Min Operating Temperature: -55°C; Width: 0.031inch; Tolerance: 10%; Case/Package: 0603; Radiation Hardening: No; Case Code (Imperial): 0603; Thickness: 0.035inch; Lead Free: Lead Free; Max Operating Temperature: 85°C; Voltage Rating (DC): 25V
C7 = CMP-2000-05997-2: CAP CER 4.7UF 10V X5R 0402; Dielectric Material: Ceramic; Tolerance: 10%; Series: C; Package Quantity: 10000; Max Operating Temperature: 85°C; Case Code (Imperial): 0402; Lead Free: Lead Free; Voltage Rating (DC): 10V; Packaging: Cut Tape; Voltage Rating: 10V; Min Operating Temperature: -55°C; Dielectric: X5R; Thickness: 0.022inch; Width: 0.02inch; Case/Package: 0402; Case Code (Metric): 1005; Length: 0.039inch; RoHS Compliant: Yes; REACH SVHC: No SVHC; Mount: Surface Mount
C8 C9 = CMP-2006-02259-2: CAP CER 2.2UF 16V X5R 0603; Dielectric Material: Ceramic; Tolerance: 10%; Dissipation Factor: 5%; Series: C; Voltage Rating (DC): 16V; REACH SVHC: No SVHC; RoHS Compliant: Yes; Number of Pins: 2; Max Operating Temperature: 85°C; Voltage Rating: 16V; Min Operating Temperature: -55°C; Termination: SMD/SMT; Dielectric: X5R; Packaging: Tape and Reel; Contact Plating: Tin; Case Code (Metric): 1608; Height: 0.8mm; Case/Package: 0603; Width: 0.8mm; Construction: Flat; Depth: 0.8mm; Thickness: 0.034inch; Radiation Hardening: No; Length: 1.6mm; Mount: Surface Mount; Case Code (Imperial): 0603; Voltage: 16V; Package Quantity: 1; Lead Free: Lead Free
C10 C12 C14-C20 = CMP-2006-03300-1: as C38 on sheet MicroSD; Part Number: C0603X104K5RACTU; Supplier 1: Digi-Key; Supplier Part Number 1: 399-7969-1-ND; Manufacturer Part Number: C0603X104K5RACTU; Stock 1: 2206541; Pricing 1: 1 = 0.21000, 10 = 0.14500, 100 = 0.07340, 500 = 0.05024, 1000 = 0.04444 (USD); RoHS: Yes; Mount: Surface Mount; Case/Package: 0603; Number of Pins: 2; Case Code (Metric): 1608; Min Operating Temperature: -55°C; Max Operating Temperature: 125°C; Packaging: Tape and Reel; Package Quantity: 1; Voltage Rating (DC): 50V; Termination: SMD/SMT; Voltage: 50V; Features: Soft Termination; Length: 1.6mm; Height: 0.8mm; Width: 0.8mm; Depth: 0.8mm; Thickness: 0.034inch; Radiation Hardening: No; REACH SVHC: No SVHC; ComponentLink1URL: https://datasheet.ciiva.com/7823/1776088-7823908.pdf?src-supplier=Element14; ComponentLink1Description: https://datasheet.ciiva.com/7823/1776088-7823908.pdf?src-supplier=Element14; ComponentLink2URL: https://datasheet.ciiva.com/26948/getdatasheetpartid-385607-26948458.pdf?src-supplier=Verical; ComponentLink2Description: https://datasheet.ciiva.com/26948/getdatasheetpartid-385607-26948458.pdf?src-supplier=Verical; ComponentLink3URL: https://datasheet.ciiva.com/7823/1776088-7823909.pdf?src-supplier=Element14; ComponentLink3Description: https://datasheet.ciiva.com/7823/1776088-7823909.pdf?src-supplier=Element14; ComponentLink4URL: https://datasheet.ciiva.com/6279/kem-c1013-x7r-ft-cap-smd-6279993.pdf?src-supplier=Digi-Key; ComponentLink4Description: https://datasheet.ciiva.com/6279/kem-c1013-x7r-ft-cap-smd-6279993.pdf?src-supplier=Digi-Key; ComponentLink5URL: https://datasheet.ciiva.com/28533/1918693-28533212.pdf?src-supplier=Element14; ComponentLink5Description: https://datasheet.ciiva.com/28533/1918693-28533212.pdf?src-supplier=Element14; ComponentLink6URL: https://datasheet.ciiva.com/6279/kem-c1013-x7r-ft-cap-smd-6279999.pdf?src-supplier=Digi-Key; ComponentLink6Description: https://datasheet.ciiva.com/6279/kem-c1013-x7r-ft-cap-smd-6279999.pdf?src-supplier=Digi-Key; ComponentLink7URL: https://datasheet.ciiva.com/6279/kem-c1013-x7r-ft-cap-smd-6279990.pdf?src-supplier=Digi-Key; ComponentLink7Description: https://datasheet.ciiva.com/6279/kem-c1013-x7r-ft-cap-smd-6279990.pdf?src-supplier=Digi-Key; ComponentLink8URL: https://datasheet.ciiva.com/14597/70096394-14597743.pdf?src-supplier=Allied+Electronics; ComponentLink8Description: https://datasheet.ciiva.com/14597/70096394-14597743.pdf?src-supplier=Allied+Electronics
DS4 = CMP-2000-05062-1: Chip LED, Green, 2.2 V, -40 to 85 degC, 2-Pin SMD, Pb-Free, Tape and Reel; Manufacturer: Avago; No. of Pins: 2; Peak Wavelength: 570nm; SVHC: NoSVHC(16-Jun-2014); Dominant Wavelength: 572nm; Forward Current If: 20mA; Viewing Angle: 170deg; Lens Shape: Rectangular; PIV Max: 5V; External Width: 1.25mm; LED Type: Standard; External Depth: 0.8mm; Opto Mounting Orientation: Top; Luminous Intensity: 15mcd; Luminous Intensity Min: 4mcd; Forward Voltage VF Max: 2.6V; External Length / Height: 2mm; Bulb Size: 1.25mmx1.4mm; Light Area Height: 1mm; Voltage Vf Typ: 2.2V; Operating Temperature Max: 85degC; Datasheet Version: Oct-08; MSL: MSL2A-4weeks; Peak Forward Current: 20mA; Package Description: 2-Pin Surface Mount Device, Body 2 x 1.25 mm, Height 0.8 mm; Datasheet URL: https://datasheet.ciiva.com/29280/180495-da-01-en-chip-led-hsmg-c170-gelb-gruen-29280971.pdf; Storage Temperature Min: -40degC; LED Colour: Green; Wavelength Typ: 570nm; Mounting Type: SMD; Forward Current If Max: 20mA; Dominant Wavelength Typ: 572nm; LED Mounting: SMD; Operating Temperature Range: -30degCto+85degC; Operating Temperature Min: -30degC; Manufacturer URL: http://www.avagotech.com/; Packaging: CutTape; Luminous Intensity Typ: 15mcd; Package Reference: HSMX-C170; Storage Temperature Max: 85degC; Opto Case Style: SMD; Forward Voltage: 2.2V
R4 R5 = CMP-2003-02030-2: RES Thick Film, 2kΩ, 5%, 0.25W, 200ppm/°C, 1206; Resistance: 2kR; Max Power Dissipation: 250mW; Voltage Rating: 200V; Case Code (Imperial): 1206; Min Operating Temperature: -55°C; Number of Pins: 2; Tolerance: 5%; Contact Plating: Tin; Temperature Coefficient: 200ppm/°C; Features: Automotive AEC-Q200; Max Operating Temperature: 155°C; Military Standard: Not; Package Quantity: 1; Radiation Hardening: No; Composition: Thick Film; Weight: 0.000353oz; Number of Terminations: 2; Width: 0.063inch; Length: 3.2mm; Depth: 1.6mm; Voltage Rating (DC): 200V; Power Rating: 250mW; Height: 0.024inch; Case/Package: 1206; Lead Free: Lead Free; Case Code (Metric): 3216; Packaging: Tape and Reel
R6 R7 = CMP-2000-05022-1: as R59 on sheet MicroSD; Package Reference: 603; Series: RC; Case Code - mm: 1608; Packaging: Reel; Datasheet URL: http://www.farnell.com/datasheets/443971.pdf; Datasheet Version: Rev. 4, 04/2009; Operating Temperature Range: -55Cto+155C; Product: ThickFilmResistorsGeneralPurpose; Package Description: 2-Pin Surface Mount Device, Body 1.6 x 0.8 mm; Manufacturer URL: http://www.yageo.com/; Case Code - in: 0603; Tolerance: 5%; Termination Style: SMD/SMT
R8 = CMP-03211-004918-1: RES SMD 56.2 OHM 0.1% 1/6W 0603; Manufacturer: TE Connectivity; Resistance: 56.2Ω; Value: 56.2Ω; Power Rating: 0.166W; Voltage Rating: 100V; Temperature Coefficient: 25ppm/°C; Tolerance: 0.001; ComponentLink2URL: https://www.te.com/commerce/DocumentDelivery/DDEController?Action=srchrtrv&DocNm=1773272&DocType=DS&DocLang=English; RoHS: TRUE; Temperature Range Low: -55°C; Octopart: https://octopart.com/rp73pf1j56r2btdf-te+connectivity-45466141; Ipc Land Pattern Name: RESC15580X45; Automotive: No; Category: Res; Lead Free: Yes; Device Class L2: Resistors; Device Class L3: Chip SMD Resistors; Temperature: -55°C to +155°C; Digikey Description: RES SMD 56.2 OHM 0.1% 1/6W 0603; ComponentLink2Description: Datasheet; Manufacturer Part Number: RP73PF1J56R2BTDF; Device Class L1: Passive Components; Composition: Thin Film; Series: RP73P; Temperature Range High: +155°C; Height: 0.55mm; Package: RP73P-1J
U3 = STM32F417VGT6TR: RISC Microcontroller, 32-Bit, FLASH, CORTEX-M4 CPU, 168MHz, CMOS, PQFP100; Manufacturer: STMicroelectronics; Package Body Material: Plastic; Max Frequency: 26MHz; Number of I/O Lines: 82; Package Equivalence Code: QFP100,.63SQ,20; Power Supplies: 2/3.3V; Speed: 168RPM; Max Supply Current: 109mA; Max Supply Voltage: 3.6V; Min Supply Voltage: 1.8V; Supply Voltage-Nom: 3.3V; Qualification Status: Not Qualified; Supplier 1: Mouser; Manufacturer Part Number: STM32F417VGT6TR; RoHS: Yes; Category: Microcontrollers; Stock 1: 905; Pricing 1: 1=15.23, 10=14, 25=13.42, 50=13.42, 100=11.9, 1000=11.87, 10000=11.87 (USD); Package Code: LFQFP; Number of Pins: 100; Package Shape: Square; Min Operating Temperature: -40°C; Max Operating Temperature: 85°C; JESD-30 Code: S-PQFP-G100; Package Style: FLATPACK, LOW PROFILE, FINE PITCHMeter; Surface Mount: Yes; Technology: CMOS; Terminal Form: Gull Wing; Terminal Position: QUAD; Length: 14mm; Width: 14mm; Height - Seated (Max): 1.6mm; Terminal Pitch: 0.5mm; Reach SVHC Compliant: Yes; RoHS Compliant: Yes; Temperature Grade: INDUSTRIAL; ComponentLink1URL: https://datasheet.ciiva.com:443/pdfs/VipMasterIC/IC/SGST/SGST-S-A0002807758/SGST-S-A0002807758-1.pdf?src-supplier=IHS+Markit; ComponentLink1Description: https://datasheet.ciiva.com:443/pdfs/VipMasterIC/IC/SGST/SGST-S-A0002807758/SGST-S-A0002807758-1.pdf?src-supplier=IHS+Markit; ComponentLink2URL: https://datasheet.ciiva.com/29987/dm00035129-29987056.pdf?src-supplier=Avnet; ComponentLink2Description: https://datasheet.ciiva.com/29987/dm00035129-29987056.pdf?src-supplier=Avnet; Supplier Part Number 1: 511-STM32F417VGT6TR